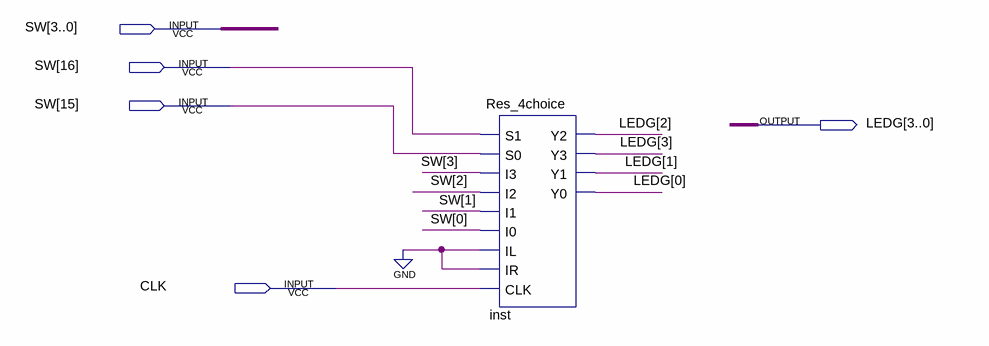
[diagram p0: schematic sheet]
// Quartus schematic BoShilf.bdf as structural Verilog: 1 symbols, 5 pins
module BoShilf (
  input  [16:0] SW,
  input  CLK,
  output [3:0] LEDG
);

  Res_4choice inst (
    .S1(SW[16]), .S0(SW[15]), .I3(SW[3]), .I2(SW[2]), .I1(SW[1]), .I0(SW[0]), .IL(1'b0), .IR(1'b0),
    .CLK(CLK), .Y2(LEDG[2]), .Y3(LEDG[3]), .Y1(LEDG[1]), .Y0(LEDG[0]));
endmodule
